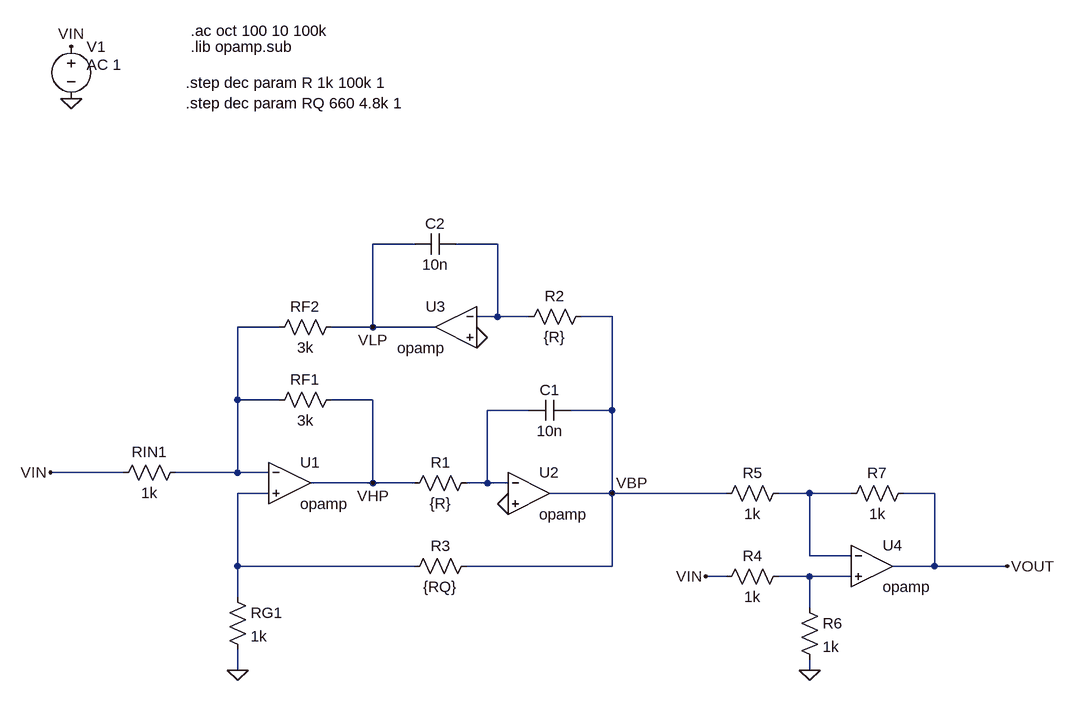
[diagram p0: schematic bell_math.asc]
bell_math.asc, the LTspice schematic file:
Version 4.1
SHEET 1 880 756
WIRE -336 -272 -400 -272
WIRE -208 -272 -272 -272
WIRE -208 -160 -208 -272
WIRE -208 -160 -240 -160
WIRE -160 -160 -208 -160
WIRE -32 -160 -80 -160
WIRE -544 -144 -608 -144
WIRE -400 -144 -400 -272
WIRE -400 -144 -464 -144
WIRE -304 -144 -400 -144
WIRE -608 -32 -608 -144
WIRE -544 -32 -608 -32
WIRE -400 -32 -464 -32
WIRE -160 -16 -224 -16
WIRE -32 -16 -32 -160
WIRE -32 -16 -96 -16
WIRE -784 80 -896 80
WIRE -608 80 -608 -32
WIRE -608 80 -704 80
WIRE -560 80 -608 80
WIRE -400 96 -400 -32
WIRE -400 96 -496 96
WIRE -336 96 -400 96
WIRE -224 96 -224 -16
WIRE -224 96 -256 96
WIRE -192 96 -224 96
WIRE -560 112 -608 112
WIRE -32 112 -32 -16
WIRE -32 112 -128 112
WIRE 144 112 -32 112
WIRE 272 112 224 112
WIRE 336 112 272 112
WIRE 464 112 416 112
WIRE 272 208 272 112
WIRE 336 208 272 208
WIRE -608 224 -608 112
WIRE -336 224 -608 224
WIRE -32 224 -32 112
WIRE -32 224 -256 224
WIRE 464 224 464 112
WIRE 464 224 400 224
WIRE 576 224 464 224
WIRE 144 240 112 240
WIRE 272 240 224 240
WIRE 336 240 272 240
WIRE -608 272 -608 224
WIRE 272 288 272 240
WIRE -608 384 -608 352
WIRE 272 384 272 368
FLAG -896 80 VIN
FLAG -864 -576 VIN
FLAG -864 -496 0
FLAG -192 128 0
FLAG -240 -128 0
FLAG -608 384 0
FLAG -400 -144 VLP
FLAG -32 112 VBP
FLAG -400 96 VHP
FLAG 272 384 0
FLAG 112 240 VIN
FLAG 576 224 VOUT
SYMBOL OpAmps\\opamp -528 32 R0
SYMATTR InstName U1
SYMBOL res -688 64 R90
WINDOW 0 0 56 VBottom 2
WINDOW 3 32 56 VTop 2
SYMATTR InstName RIN1
SYMATTR Value 1k
SYMBOL voltage -864 -592 R0
WINDOW 123 24 44 Left 2
WINDOW 39 0 0 Left 0
SYMATTR Value2 AC 1
SYMATTR InstName V1
SYMATTR Value ""
SYMBOL res -448 -48 R90
WINDOW 0 0 56 VBottom 2
WINDOW 3 32 56 VTop 2
SYMATTR InstName RF1
SYMATTR Value 3k
SYMBOL res -240 80 R90
WINDOW 0 0 56 VBottom 2
WINDOW 3 32 56 VTop 2
SYMATTR InstName R1
SYMATTR Value {R}
SYMBOL OpAmps\\opamp -160 48 R0
SYMATTR InstName U2
SYMBOL cap -96 -32 R90
WINDOW 0 0 32 VBottom 2
WINDOW 3 32 32 VTop 2
SYMATTR InstName C1
SYMATTR Value 10n
SYMBOL res -64 -176 R90
WINDOW 0 0 56 VBottom 2
WINDOW 3 32 56 VTop 2
SYMATTR InstName R2
SYMATTR Value {R}
SYMBOL OpAmps\\opamp -272 -208 M0
SYMATTR InstName U3
SYMBOL cap -336 -288 M90
WINDOW 0 0 32 VBottom 2
WINDOW 3 32 32 VTop 2
SYMATTR InstName C2
SYMATTR Value 10n
SYMBOL res -448 -160 R90
WINDOW 0 0 56 VBottom 2
WINDOW 3 32 56 VTop 2
SYMATTR InstName RF2
SYMATTR Value 3k
SYMBOL res -240 208 R90
WINDOW 0 0 56 VBottom 2
WINDOW 3 32 56 VTop 2
SYMATTR InstName R3
SYMATTR Value {RQ}
SYMBOL res -624 256 R0
SYMATTR InstName RG1
SYMATTR Value 1k
SYMBOL OpAmps\\opamp 368 160 R0
SYMATTR InstName U4
SYMBOL res 240 224 R90
WINDOW 0 0 56 VBottom 2
WINDOW 3 32 56 VTop 2
SYMATTR InstName R4
SYMATTR Value 1k
SYMBOL res 240 96 R90
WINDOW 0 0 56 VBottom 2
WINDOW 3 32 56 VTop 2
SYMATTR InstName R5
SYMATTR Value 1k
SYMBOL res 256 272 R0
SYMATTR InstName R6
SYMATTR Value 1k
SYMBOL res 432 96 R90
WINDOW 0 0 56 VBottom 2
WINDOW 3 32 56 VTop 2
SYMATTR InstName R7
SYMATTR Value 1k
TEXT -680 -600 Left 2 !.ac oct 100 10 100k
TEXT -680 -576 Left 2 !.lib opamp.sub
TEXT -688 -520 Left 2 !.step dec param R 1k 100k 1\n.step dec param RQ 660 4.8k 1

The netlist it stands for:
* bell_math.asc
X§U1 N002 N004 VHP opamp Aol=100K GBW=10Meg  ; pins invin noninvin out
RIN1 N002 VIN 1k
V1 VIN 0 AC 1
RF1 VHP N002 3k
R1 N003 VHP {R}
X§U2 N003 0 VBP opamp Aol=100K GBW=10Meg  ; pins invin noninvin out
C1 VBP N003 10n
R2 VBP N001 {R}
X§U3 N001 0 VLP opamp Aol=100K GBW=10Meg  ; pins invin noninvin out
C2 VLP N001 10n
RF2 VLP N002 3k
R3 VBP N004 {RQ}
RG1 N004 0 1k
X§U4 N005 N006 VOUT opamp Aol=100K GBW=10Meg  ; pins invin noninvin out
R4 N006 VIN 1k
R5 N005 VBP 1k
R6 N006 0 1k
R7 VOUT N005 1k
.ac oct 100 10 100k
.lib opamp.sub
.step dec param R 1k 100k 1
.step dec param RQ 660 4.8k 1
.backanno
.end

* Results of the author's LTspice run, read from the files saved beside the schematic
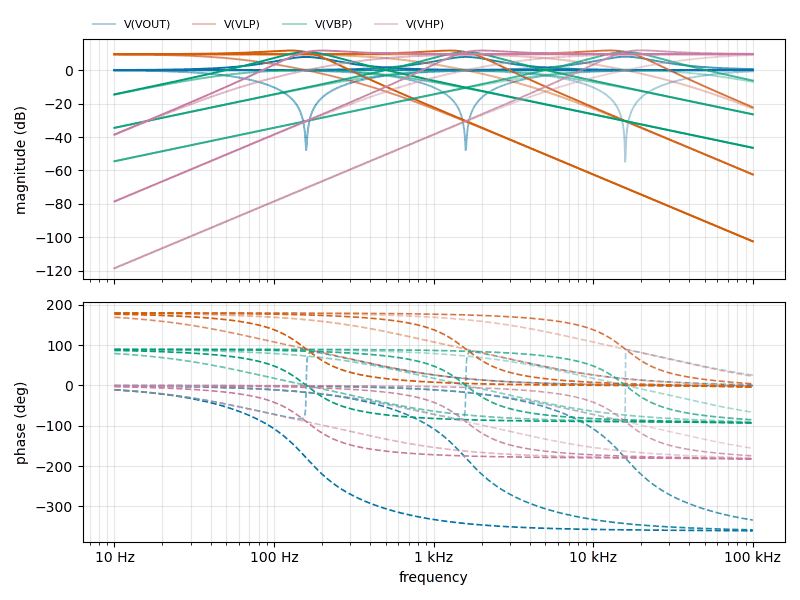
[diagram p1: AC Analysis of bell_math.asc, plotted from the saved traces]
* AC Analysis, 6 runs:
*   V(VOUT) [r=1000 rq=660]: -0.00 dB at 10 Hz, -0.72 dB at 100 kHz, peak -0.00 dB at 10 Hz, 3 dB below the peak at 4.798 kHz
*   V(VOUT) [r=10000 rq=660]: -0.00 dB at 10 Hz, 0.01 dB at 100 kHz, peak 0.01 dB at 100 kHz, 3 dB below the peak at 5.271 kHz
*   V(VOUT) [r=100000 rq=660]: -0.15 dB at 10 Hz, 0.00 dB at 100 kHz, peak 0.00 dB at 49.05 kHz, 3 dB below the peak at 527.4 Hz
*   V(VOUT) [r=1000 rq=4800]: -0.00 dB at 10 Hz, 0.65 dB at 100 kHz, peak 8.05 dB at 15.96 kHz, 3 dB below the peak at 9.76 kHz and 26.44 kHz
*   V(VOUT) [r=10000 rq=4800]: 0.00 dB at 10 Hz, 0.03 dB at 100 kHz, peak 7.90 dB at 1.598 kHz, 3 dB below the peak at 963.6 Hz and 2.634 kHz
*   V(VOUT) [r=100000 rq=4800]: 0.07 dB at 10 Hz, 0.00 dB at 100 kHz, peak 7.89 dB at 158.9 Hz, 3 dB below the peak at 96.23 Hz and 263.3 Hz
*   V(VLP) [r=1000 rq=660]: 9.54 dB at 10 Hz, -22.92 dB at 100 kHz, peak 9.54 dB at 10 Hz, 3 dB below the peak at 5.925 kHz
*   V(VLP) [r=10000 rq=660]: 9.54 dB at 10 Hz, -62.38 dB at 100 kHz, peak 9.54 dB at 10 Hz, 3 dB below the peak at 592.8 Hz
*   V(VLP) [r=100000 rq=660]: 9.42 dB at 10 Hz, -102.39 dB at 100 kHz, peak 9.42 dB at 10 Hz, 3 dB below the peak at 60.87 Hz
*   V(VLP) [r=1000 rq=4800]: 9.54 dB at 10 Hz, -22.21 dB at 100 kHz, peak 11.78 dB at 12.69 kHz, 3 dB below the peak at 18.93 kHz
*   V(VLP) [r=10000 rq=4800]: 9.54 dB at 10 Hz, -62.39 dB at 100 kHz, peak 11.73 dB at 1.262 kHz, 3 dB below the peak at 1.888 kHz
*   V(VLP) [r=100000 rq=4800]: 9.56 dB at 10 Hz, -102.40 dB at 100 kHz, peak 11.72 dB at 126.4 Hz, 3 dB below the peak at 188.7 Hz
*   V(VBP) [r=1000 rq=660]: -54.48 dB at 10 Hz, -6.94 dB at 100 kHz, peak -0.00 dB at 16.18 kHz, 3 dB below the peak at 4.822 kHz and 53.91 kHz
*   V(VBP) [r=10000 rq=660]: -34.49 dB at 10 Hz, -26.42 dB at 100 kHz, peak -0.03 dB at 1.598 kHz, 3 dB below the peak at 480.5 Hz and 5.285 kHz
*   V(VBP) [r=100000 rq=660]: -14.61 dB at 10 Hz, -46.43 dB at 100 kHz, peak -0.03 dB at 158.9 Hz, 3 dB below the peak at 48.03 Hz and 527.5 Hz
*   V(VBP) [r=1000 rq=4800]: -54.48 dB at 10 Hz, -6.24 dB at 100 kHz, peak 10.94 dB at 15.96 kHz, 3 dB below the peak at 10.53 kHz and 24.16 kHz
*   V(VBP) [r=10000 rq=4800]: -34.49 dB at 10 Hz, -26.43 dB at 100 kHz, peak 10.84 dB at 1.587 kHz, 3 dB below the peak at 1.048 kHz and 2.419 kHz
*   V(VBP) [r=100000 rq=4800]: -14.47 dB at 10 Hz, -46.43 dB at 100 kHz, peak 10.83 dB at 158.9 Hz, 3 dB below the peak at 104.7 Hz and 241.9 Hz
*   V(VHP) [r=1000 rq=660]: -118.46 dB at 10 Hz, 9.03 dB at 100 kHz, peak 9.03 dB at 100 kHz, 3 dB below the peak at 37.43 kHz
*   V(VHP) [r=10000 rq=660]: -78.53 dB at 10 Hz, 9.55 dB at 100 kHz, peak 9.55 dB at 92.16 kHz, 3 dB below the peak at 4.267 kHz
*   V(VHP) [r=100000 rq=660]: -38.65 dB at 10 Hz, 9.53 dB at 100 kHz, peak 9.54 dB at 29.16 kHz, 3 dB below the peak at 427.3 Hz
*   V(VHP) [r=1000 rq=4800]: -118.46 dB at 10 Hz, 9.74 dB at 100 kHz, peak 11.85 dB at 20.06 kHz, 3 dB below the peak at 13.45 kHz
*   V(VHP) [r=10000 rq=4800]: -78.53 dB at 10 Hz, 9.54 dB at 100 kHz, peak 11.74 dB at 2.009 kHz, 3 dB below the peak at 1.342 kHz
*   V(VHP) [r=100000 rq=4800]: -38.51 dB at 10 Hz, 9.53 dB at 100 kHz, peak 11.73 dB at 201.1 Hz, 3 dB below the peak at 134.2 Hz